# EAGLE schematic untitled (EAGLE 9.1.0)
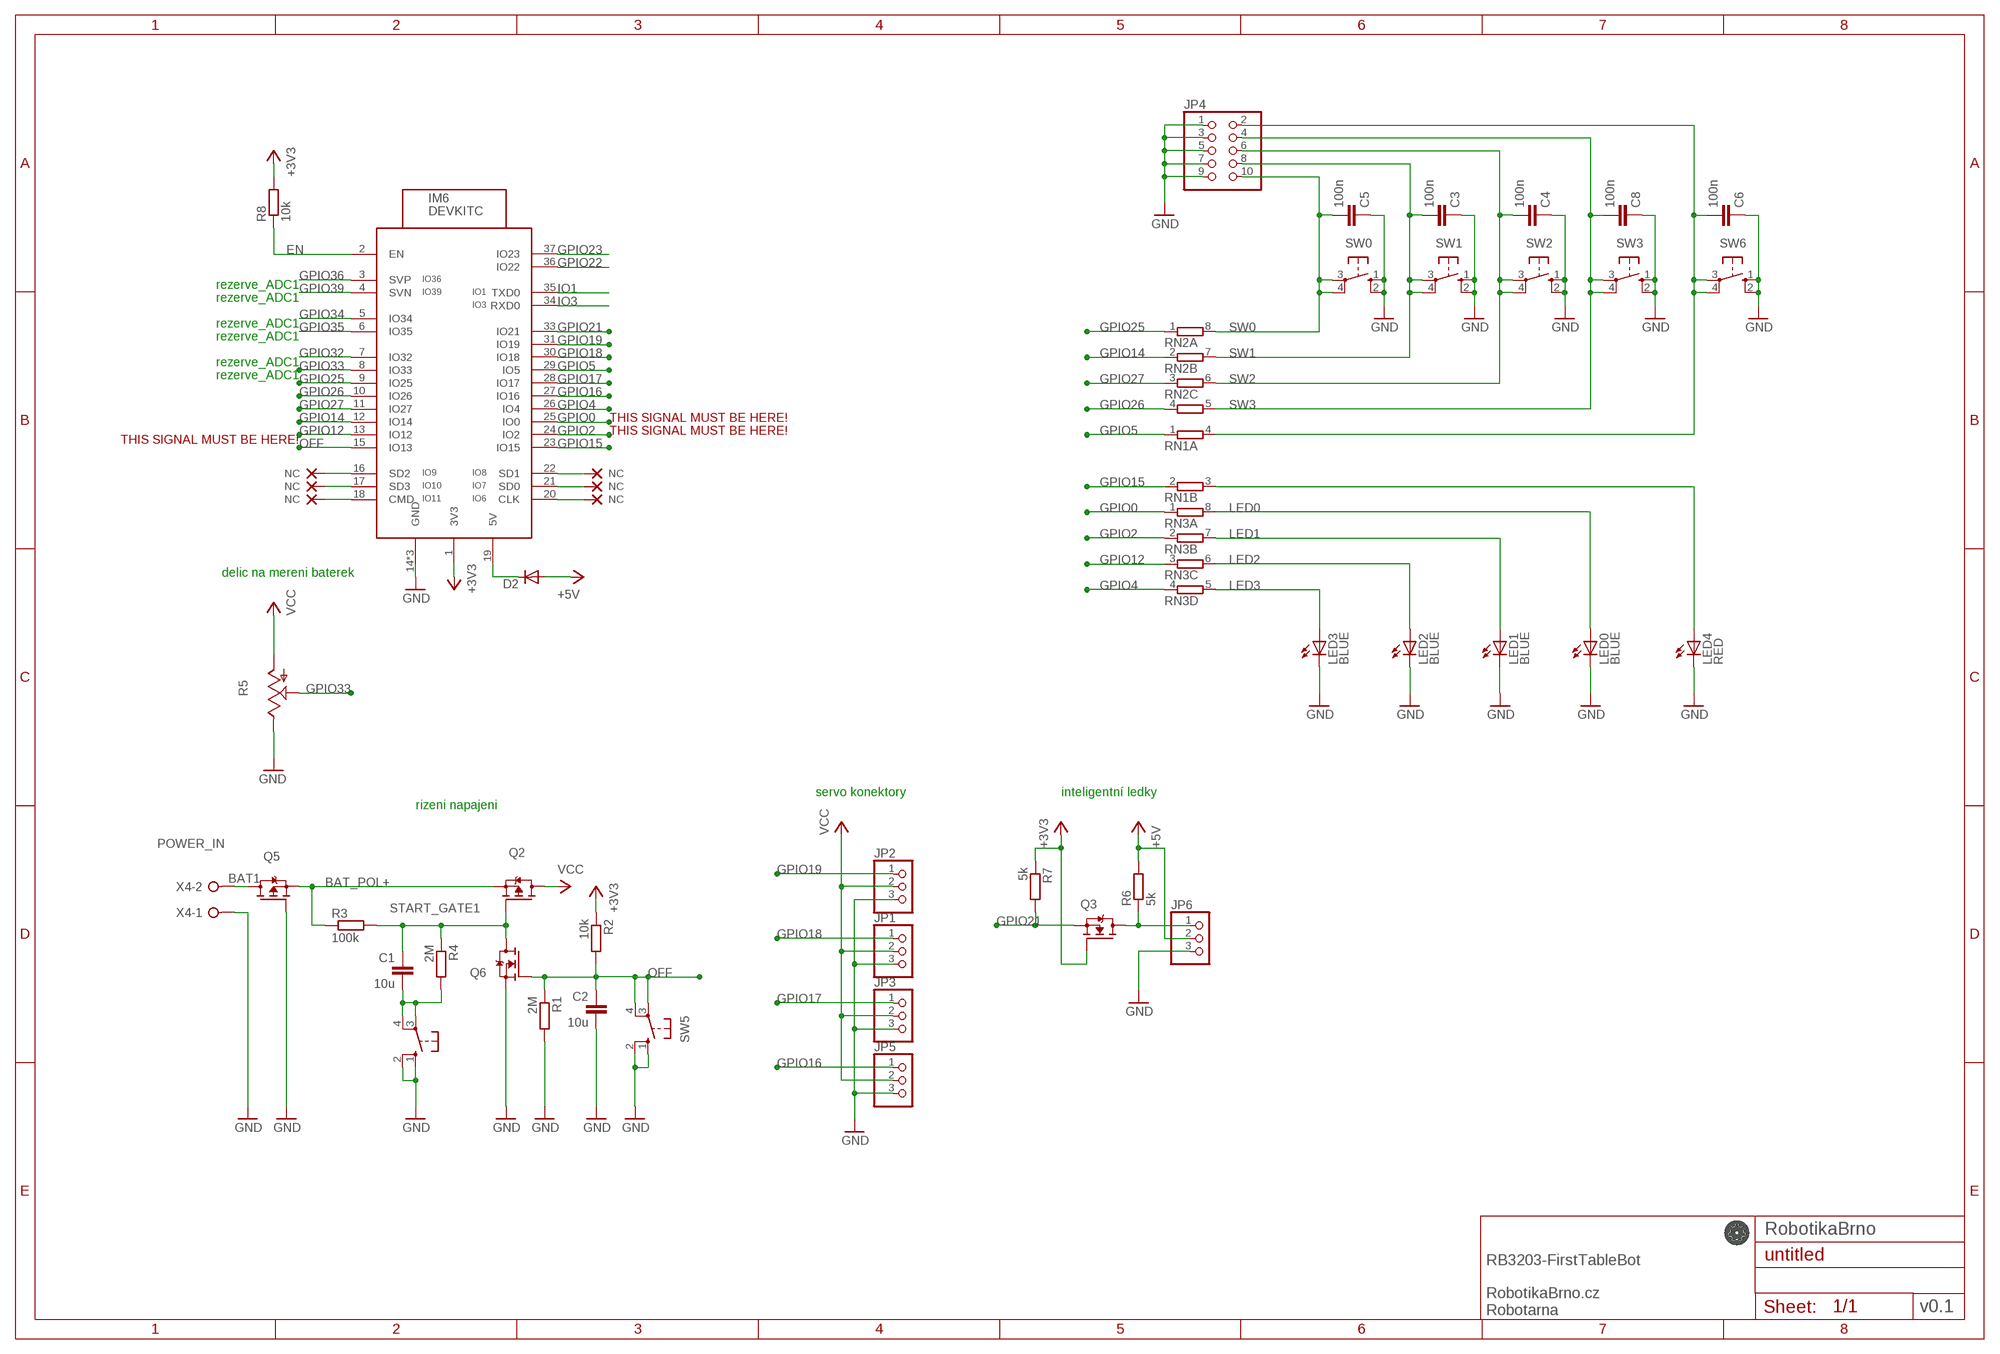
[diagram p0: schematic, sheet 1]

## Parts
C1  10u  C-EUC1206  [C1206]
C2  10u  C-EUC1206  [C1206]
C3  100n  C-EUC1206  [C1206]
C4  100n  C-EUC1206  [C1206]
C5  100n  C-EUC1206  [C1206]
C6  100n  C-EUC1206  [C1206]
C8  100n  C-EUC1206  [C1206]
D2  DIODE-D-7.5  [D-7.5]
IM6  DEVKITC  [DEVKITC]
JP1  PINHD-1X3  [1X03]
JP2  PINHD-1X3  [1X03]
JP3  PINHD-1X3  [1X03]
JP4  PINHD-2X5  [2X05]
JP5  PINHD-1X3  [1X03]
JP6  PINHD-1X3  [1X03]
LED0  BLUE  LED3MM  [LED3MM]
LED1  BLUE  LED3MM  [LED3MM]
LED2  BLUE  LED3MM  [LED3MM]
LED3  BLUE  LED3MM  [LED3MM]
LED4  RED  LED3MM  [LED3MM]
NC1  NC  (no package)
NC2  NC  (no package)
NC3  NC  (no package)
NC4  NC  (no package)
NC5  NC  (no package)
NC6  NC  (no package)
Q2  P-MOSFET-MLP_HS  [MLP3.3X3.3_HS]
Q3  N-MOSFET-SOT23-DIST  [SOT23_DIST]
Q5  P-MOSFET-MLP_HS  [MLP3.3X3.3_HS]
Q6  N-MOSFET-SOT23-GSD  [SOT23]
R1  2M  R-EU_R0805  [R0805]
R2  10k  R-EU_R0805  [R0805]
R3  100k  R-EU_R0805  [R0805]
R4  2M  R-EU_M0805  [M0805]
R5  TRIM_US-SM-42/43X  [SM-42/43X]
R6  5k  R-EU_R0402  [R0402]
R7  5k  R-EU_R0402  [R0402]
R8  10k  R-EU_R0805  [R0805]
RN1  2R-NEXB24V  [EXB24V]
RN2  4R-N0402ARV341  [4X0402ARV341]
RN3  4R-N0402ARV341  [4X0402ARV341]
SW0  10-XX  [B3F-10XX]
SW1  10-XX  [B3F-10XX]
SW2  10-XX  [B3F-10XX]
SW3  10-XX  [B3F-10XX]
SW4  10-XX  [B3F-10XX]
SW5  10-XX  [B3F-10XX]
SW6  10-XX  [B3F-10XX]
X4  POWER_IN  W237-02P  [W237-132]

## Nets
+3V3: IM6.1(3V3) Q3.1(G) R2.1 R7.1 R8.2
+5V: D2.A JP6.2 R6.2
+5V_ESP: D2.C IM6.19(5V)
BAT1: Q5.5(D) Q5.6(D) Q5.7(D) Q5.8(D) X4.2
BAT_POL+: Q2.1(S) Q2.2(S) Q2.3(S) Q5.1(S) Q5.2(S) Q5.3(S) R3.1
EN: IM6.2(EN) R8.1
GND: C2.2 C3.1 C4.1 C5.1 C6.1 C8.1 IM6.14(GND) IM6.32(GND) IM6.38(GND) JP1.3 JP2.3 JP3.3 JP4.1 JP4.3 JP4.5 JP4.7 JP4.9 JP5.3 JP6.3 LED0.K(C) LED1.K(C) LED2.K(C) LED3.K(C) LED4.K(C) Q5.4(G) Q6.2(S) R1.2 R5.3(E) SW0.1(S) SW0.2(S1) SW1.1(S) SW1.2(S1) SW2.1(S) SW2.2(S1) SW3.1(S) SW3.2(S1) SW4.1(S) SW4.2(S1) SW5.1(S) SW5.2(S1) SW6.1(S) SW6.2(S1) X4.1
GPIO0: IM6.25(IO0) RN3.1
GPIO2: IM6.24(IO2) RN3.2
GPIO4: IM6.26(IO4) RN3.4
GPIO5: IM6.29(IO5) RN1.1
GPIO12: IM6.13(IO12) RN3.3
GPIO14: IM6.12(IO14) RN2.2
GPIO15: IM6.23(IO15) RN1.2
GPIO16: IM6.27(IO16) JP5.1
GPIO17: IM6.28(IO17) JP3.1
GPIO18: IM6.30(IO18) JP1.1
GPIO19: IM6.31(IO19) JP2.1
GPIO21: IM6.33(IO21) Q3.2(S) R7.2
GPIO22: IM6.36(IO22)
GPIO23: IM6.37(IO23)
GPIO25: IM6.9(IO25) RN2.1
GPIO26: IM6.10(IO26) RN2.4
GPIO27: IM6.11(IO27) RN2.3
GPIO32: IM6.7(IO32)
GPIO33: IM6.8(IO33) R5.2(S)
GPIO34: IM6.5(IO34)
GPIO35: IM6.6(IO35)
GPIO36: IM6.3(SVP)
GPIO39: IM6.4(SVN)
IO1: IM6.35(TXD0)
IO3: IM6.34(RXD0)
IO9_NC: IM6.16(SD2) NC1.NC
IO9_NC1: IM6.20(CLK) NC4.NC
IO10_NC: IM6.17(SD3) NC2.NC
IO10_NC1: IM6.21(SD0) NC5.NC
IO11_NC: IM6.18(CMD) NC3.NC
IO11_NC1: IM6.22(SD1) NC6.NC
LED0: LED0.A RN3.8
LED1: LED1.A RN3.7
LED2: LED2.A RN3.6
LED3: LED3.A RN3.5
N$2: JP4.2
N$5: LED4.A RN1.3
N$6: JP6.1 Q3.3(D) R6.1
OFF: C2.1 IM6.15(IO13) Q6.1(G) R1.1 R2.2 SW5.3(P) SW5.4(P1)
ON: C1.2 R4.2 SW4.3(P) SW4.4(P1)
START_GATE1: C1.1 Q2.4(G) Q6.3(D) R3.2 R4.1
SW0: C5.2 JP4.10 RN2.8 SW0.3(P) SW0.4(P1)
SW1: C3.2 JP4.8 RN2.7 SW1.3(P) SW1.4(P1)
SW2: C4.2 JP4.6 RN2.6 SW2.3(P) SW2.4(P1)
SW3: C8.2 JP4.4 RN2.5 SW3.3(P) SW3.4(P1)
SW4: C6.2 RN1.4 SW6.3(P) SW6.4(P1)
VCC: JP1.2 JP2.2 JP3.2 JP5.2 Q2.5(D) Q2.6(D) Q2.7(D) Q2.8(D) R5.1(A)

## Notes on the sheet
- rezerve_ADC1
- rezerve_ADC1
- rezerve_ADC1
- rezerve_ADC1
- rezerve_ADC1
- rezerve_ADC1
- THIS SIGNAL MUST BE HERE!
- THIS SIGNAL MUST BE HERE! | THIS SIGNAL MUST BE HERE!
- delic na mereni baterek
- servo konektory | inteligentní ledky
- rizeni napajeni
- RobotikaBrno
- v0.1
- RB3203-FirstTableBot
  
  RobotikaBrno.cz
  Robotarna

## Library data of the parts
C1-C6 C8 = rcl_upravena:C-EU: CAPACITOR, European symbol
D2 = diode:DIODE-: DIODE
IM6 = esp32:DEVKITC
JP1-JP3 JP5 JP6 = pinhead:PINHD-1X3: PIN HEADER
JP4 = pinhead:PINHD-2X5: PIN HEADER
LED0 LED1-LED4 = led:LED: LED OSRAM: - CHIPLED LG R971, LG N971, LY N971, LG Q971, LY Q971, LO R971, LY R971 LH N974, LH R974 LS Q976, LO Q976, LY Q976 LO Q996 - Hyper CHIPLED LW Q18S LB Q993, LB Q99A, LB R99A - SideLED LS A670, LO A670, LY A670, LG A670, LP A670 LB A673, LV A673, LT A673, LW A673 LH A674 LY A675 LS A676, LA A676, LO A676, LY A676, LW A676 LS A679, LY A679, LG A679 - Hyper Micro SIDELED® LS Y876, LA Y876, LO Y876, LY Y876 LT Y87S - SmartLED LW L88C, LW L88S LB L89C, LB L89S, LG L890 LS L89K, LO L89K, LY L89K LS L896, LA L896, LO L896, LY L896 - TOPLED LS T670, LO T670, LY T670, LG T670, LP T670 LSG T670, LSP T670, LSY T670, LOP T670, LYG T670 LG T671, LOG T671, LSG T671 LB T673, LV T673, LT T673, LW T673 LH T674 LS T676, LA T676, LO T676, LY T676, LB T676, LH T676, LSB T676, LW T676 LB T67C, LV T67C, LT T67C, LS T67K, LO T67K, LY T67K, LW E67C LS E67B, LA E67B, LO E67B, LY E67B, LB E67C, LV E67C, LT E67C LW T67C LS T679, LY T679, LG T679 LS T770, LO T770, LY T770, LG T770, LP T770 LB T773, LV T773, LT T773, LW T773 LH T774 LS E675, LA E675, LY E675, LS T675 LS T776, LA T776, LO T776, LY T776, LB T776 LHGB T686 LT T68C, LB T68C - Hyper Mini TOPLED® LB M676 - Mini TOPLED Santana® LG M470 LS M47K, LO M47K, LY M47K Source: http://www.osram.convergy.de LUXEON: - LUMILED® LXK2-PW12-R00, LXK2-PW12-S00, LXK2-PW14-U00, LXK2-PW14-V00 LXK2-PM12-R00, LXK2-PM12-S00, LXK2-PM14-U00 LXK2-PE12-Q00, LXK2-PE12-R00, LXK2-PE12-S00, LXK2-PE14-T00, LXK2-PE14-U00 LXK2-PB12-K00, LXK2-PB12-L00, LXK2-PB12-M00, LXK2-PB14-N00, LXK2-PB14-P00, LXK2-PB14-Q00 LXK2-PR12-L00, LXK2-PR12-M00, LXK2-PR14-Q00, LXK2-PR14-R00 LXK2-PD12-Q00, LXK2-PD12-R00, LXK2-PD12-S00 LXK2-PH12-R00, LXK2-PH12-S00 LXK2-PL12-P00, LXK2-PL12-Q00, LXK2-PL12-R00 Source: www.luxeon.com KINGBRIGHT: KA-3528ASYC Source: www.kingbright.com
NC1-NC6 = NC:NC: _EXTERNAL_
Q2 Q5 = transistors:P-MOSFET
Q3 Q6 = transistors:N-MOSFET
R1-R4 R8 = rcl_upravena:R-EU_: RESISTOR, European symbol
R5 = pot:TRIM_US-: POTENTIOMETER
R6 R7 = resistor:R-EU_: RESISTOR, European symbol
RN1 = resistor-dil:2R-N: Array Chip Resistor Source: Panasonic; OC_FARNELL: unknown; OC_NEWARK: unknown
RN2 RN3 = resistor-dil:4R-N: Array Chip Resistor Source: RS Component / Phycomp; OC_FARNELL: unknown; OC_NEWARK: unknown
SW0 SW1-SW6 = switch-omron:10-XX: OMRON SWITCH; MPN: B3F-1000; OC_FARNELL: 176432; OC_NEWARK: 36M3542
X4 = con-wago-508:W237-02P: WAGO SREW CLAMP; OC_FARNELL: unknown; OC_NEWARK: unknown

## Net classes
0 default: width 0.2 mm, drill 0.35 mm, clearance 0.2 mm